# EAGLE design R284A (EAGLE 6.6.0)
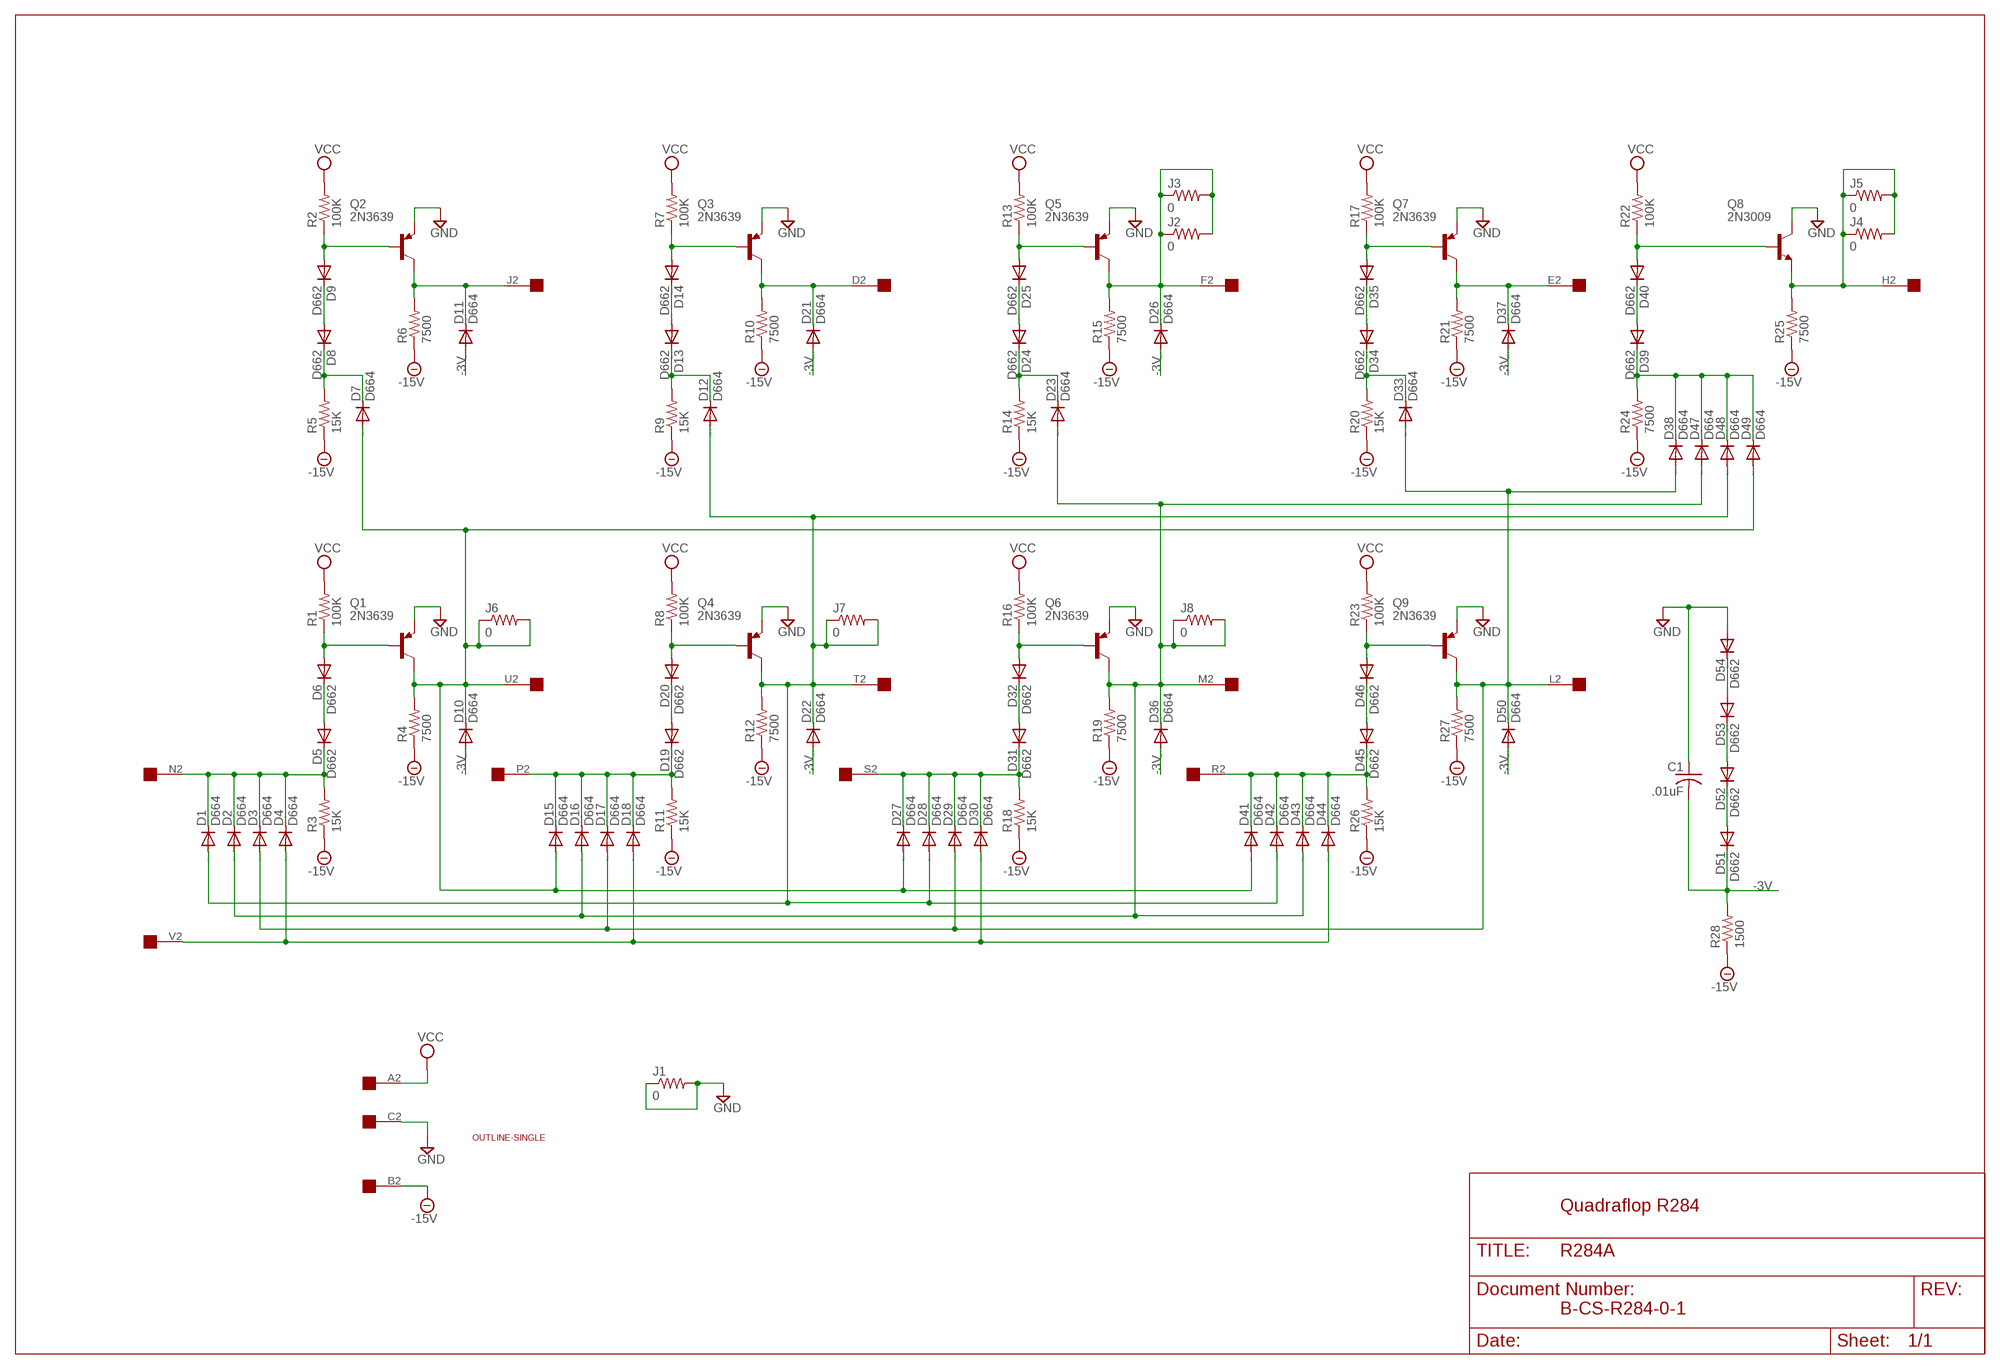
[diagram p0: schematic, sheet 1]

## Parts
C1  .01uF  C-US  [C063-025X075]
D1  D664  DIODE-DO35-10  [DO35-10]
D2  D664  DIODE-DO35-10  [DO35-10]
D3  D664  DIODE-DO35-10  [DO35-10]
D4  D664  DIODE-DO35-10  [DO35-10]
D5  D662  DIODE-DO35-10  [DO35-10]
D6  D662  DIODE-DO35-10  [DO35-10]
D7  D664  DIODE-DO35-10  [DO35-10]
D8  D662  DIODE-DO35-10  [DO35-10]
D9  D662  DIODE-DO35-10  [DO35-10]
D10  D664  DIODE-DO35-10  [DO35-10]
D11  D664  DIODE-DO35-10  [DO35-10]
D12  D664  DIODE-DO35-10  [DO35-10]
D13  D662  DIODE-DO35-10  [DO35-10]
D14  D662  DIODE-DO35-10  [DO35-10]
D15  D664  DIODE-DO35-10  [DO35-10]
D16  D664  DIODE-DO35-10  [DO35-10]
D17  D664  DIODE-DO35-10  [DO35-10]
D18  D664  DIODE-DO35-10  [DO35-10]
D19  D662  DIODE-DO35-10  [DO35-10]
D20  D662  DIODE-DO35-10  [DO35-10]
D21  D664  DIODE-DO35-10  [DO35-10]
D22  D664  DIODE-DO35-10  [DO35-10]
D23  D664  DIODE-DO35-10  [DO35-10]
D24  D662  DIODE-DO35-10  [DO35-10]
D25  D662  DIODE-DO35-10  [DO35-10]
D26  D664  DIODE-DO35-10  [DO35-10]
D27  D664  DIODE-DO35-10  [DO35-10]
D28  D664  DIODE-DO35-10  [DO35-10]
D29  D664  DIODE-DO35-10  [DO35-10]
D30  D664  DIODE-DO35-10  [DO35-10]
D31  D662  DIODE-DO35-10  [DO35-10]
D32  D662  DIODE-DO35-10  [DO35-10]
D33  D664  DIODE-DO35-10  [DO35-10]
D34  D662  DIODE-DO35-10  [DO35-10]
D35  D662  DIODE-DO35-10  [DO35-10]
D36  D664  DIODE-DO35-10  [DO35-10]
D37  D664  DIODE-DO35-10  [DO35-10]
D38  D664  DIODE-DO35-10  [DO35-10]
D39  D662  DIODE-DO35-10  [DO35-10]
D40  D662  DIODE-DO35-10  [DO35-10]
D41  D664  DIODE-DO35-10  [DO35-10]
D42  D664  DIODE-DO35-10  [DO35-10]
D43  D664  DIODE-DO35-10  [DO35-10]
D44  D664  DIODE-DO35-10  [DO35-10]
D45  D662  DIODE-DO35-10  [DO35-10]
D46  D662  DIODE-DO35-10  [DO35-10]
D47  D664  DIODE-DO35-10  [DO35-10]
D48  D664  DIODE-DO35-10  [DO35-10]
D49  D664  DIODE-DO35-10  [DO35-10]
D50  D664  DIODE-DO35-10  [DO35-10]
D51  D662  DIODE-DO35-10  [DO35-10]
D52  D662  DIODE-DO35-10  [DO35-10]
D53  D662  DIODE-DO35-10  [DO35-10]
D54  D662  DIODE-DO35-10  [DO35-10]
J1  0  R-US_0207/10  [0207/10]
J2  0  R-US_0207/10  [0207/10]
J3  0  R-US_0207/10  [0207/10]
J4  0  R-US_0207/10  [0207/10]
J5  0  R-US_0207/10  [0207/10]
J6  0  R-US_0207/10  [0207/10]
J7  0  R-US_0207/10  [0207/10]
J8  0  R-US_0207/10  [0207/10]
Q1  2N3639  -PNP-TO5  [TO5]
Q2  2N3639  -PNP-TO5  [TO5]
Q3  2N3639  -PNP-TO5  [TO5]
Q4  2N3639  -PNP-TO5  [TO5]
Q5  2N3639  -PNP-TO5  [TO5]
Q6  2N3639  -PNP-TO5  [TO5]
Q7  2N3639  -PNP-TO5  [TO5]
Q8  2N3009  -NPN-TO5  [TO5]
Q9  2N3639  -PNP-TO5  [TO5]
R1  100K  R-US_0207/10  [0207/10]
R2  100K  R-US_0207/10  [0207/10]
R3  15K  R-US_0207/10  [0207/10]
R4  7500  R-US_0207/10  [0207/10]
R5  15K  R-US_0207/10  [0207/10]
R6  7500  R-US_0207/10  [0207/10]
R7  100K  R-US_0207/10  [0207/10]
R8  100K  R-US_0207/10  [0207/10]
R9  15K  R-US_0207/10  [0207/10]
R10  7500  R-US_0207/10  [0207/10]
R11  15K  R-US_0207/10  [0207/10]
R12  7500  R-US_0207/10  [0207/10]
R13  100K  R-US_0207/10  [0207/10]
R14  15K  R-US_0207/10  [0207/10]
R15  7500  R-US_0207/10  [0207/10]
R16  100K  R-US_0207/10  [0207/10]
R17  100K  R-US_0207/10  [0207/10]
R18  15K  R-US_0207/10  [0207/10]
R19  7500  R-US_0207/10  [0207/10]
R20  15K  R-US_0207/10  [0207/10]
R21  7500  R-US_0207/10  [0207/10]
R22  100K  R-US_0207/10  [0207/10]
R23  100K  R-US_0207/10  [0207/10]
R24  7500  R-US_0207/10  [0207/10]
R25  7500  R-US_0207/10  [0207/10]
R26  15K  R-US_0207/10  [0207/10]
R27  7500  R-US_0207/10  [0207/10]
R28  1500  R-US_0207/10  [0207/10]
U$1  OUTLINE-SINGLE  [SINGLE]
U$2  EDGE-1  [EDGE-CON1]

## Nets
-3V: C1.2 D10.A D11.A D21.A D22.A D26.A D36.A D37.A D50.A D51.C R28.2
-15V: R3.1 R4.1 R5.1 R6.1 R9.1 R10.1 R11.1 R12.1 R14.1 R15.1 R18.1 R19.1 R20.1 R21.1 R24.1 R25.1 R26.1 R27.1 R28.1 U$2.B2
GND: C1.1 D54.A J1.1 J1.2 Q1.1(E) Q2.1(E) Q3.1(E) Q4.1(E) Q5.1(E) Q6.1(E) Q7.1(E) Q8.3(C) Q9.1(E) U$2.C2
N$1: D9.A Q2.2(B) R2.1
N$2: D11.C Q2.3(C) R6.2 U$2.J2
N$3: D7.C D8.C R5.2
N$4: D8.A D9.C
N$5: D6.A Q1.2(B) R1.1
N$6: D1.C D2.C D3.C D4.C D5.C R3.2 U$2.N2
N$7: D5.A D6.C
N$8: D7.A D10.C D15.A D27.A D41.A D49.A J6.1 J6.2 Q1.3(C) R4.2 U$2.U2
N$9: D1.A D12.A D22.C D28.A D42.A D48.A J7.1 J7.2 Q4.3(C) R12.2 U$2.T2
N$10: D2.A D16.A D23.A D36.C D43.A D47.A J8.1 J8.2 Q6.3(C) R19.2 U$2.M2
N$11: D3.A D17.A D29.A D33.A D38.A D50.C Q9.3(C) R27.2 U$2.L2
N$12: D4.A D18.A D30.A D44.A U$2.V2
N$13: D14.A Q3.2(B) R7.1
N$14: D21.C Q3.3(C) R10.2 U$2.D2
N$15: D12.C D13.C R9.2
N$16: D13.A D14.C
N$17: D20.A Q4.2(B) R8.1
N$18: D15.C D16.C D17.C D18.C D19.C R11.2 U$2.P2
N$19: D19.A D20.C
N$21: D51.A D52.C
N$22: D52.A D53.C
N$23: D53.A D54.C
N$25: D25.A Q5.2(B) R13.1
N$26: D26.C J2.1 J2.2 J3.1 J3.2 Q5.3(C) R15.2 U$2.F2
N$27: D23.C D24.C R14.2
N$28: D24.A D25.C
N$29: D32.A Q6.2(B) R16.1
N$30: D27.C D28.C D29.C D30.C D31.C R18.2 U$2.S2
N$31: D31.A D32.C
N$37: D35.A Q7.2(B) R17.1
N$38: D37.C Q7.3(C) R21.2 U$2.E2
N$39: D33.C D34.C R20.2
N$40: D34.A D35.C
N$41: D46.A Q9.2(B) R23.1
N$42: D41.C D42.C D43.C D44.C D45.C R26.2 U$2.R2
N$43: D45.A D46.C
N$49: D40.A Q8.2(B) R22.1
N$50: J4.1 J4.2 J5.1 J5.2 Q8.1(E) R25.2 U$2.H2
N$51: D38.C D39.C D47.C D48.C D49.C R24.2
N$52: D39.A D40.C
VCC: R1.2 R2.2 R7.2 R8.2 R13.2 R16.2 R17.2 R22.2 R23.2 U$2.A2
Unconnected: U$2.K2

## Notes on the sheet
- Quadraflop R284
- B-CS-R284-0-1

## Library data of the parts
C1 = dec-con:C-US: Capacitors with funky DEC lead spacing.
D1-D54 = diode:DIODE-: DIODE
J1-J8 R1-R28 = rcl:R-US_: RESISTOR, American symbol
Q1-Q7 Q9 = transistor:*-PNP-: PNP Transistror
Q8 = transistor:*-NPN-: NPN Transistror BF959 corrected 2008.03.06
U$1 = dec-con:OUTLINE-*: Board outlines for DEC boards.
U$2 = dec-con:EDGE-1: Single-Sided DEC Edge Connector -- (side 2)

## Board
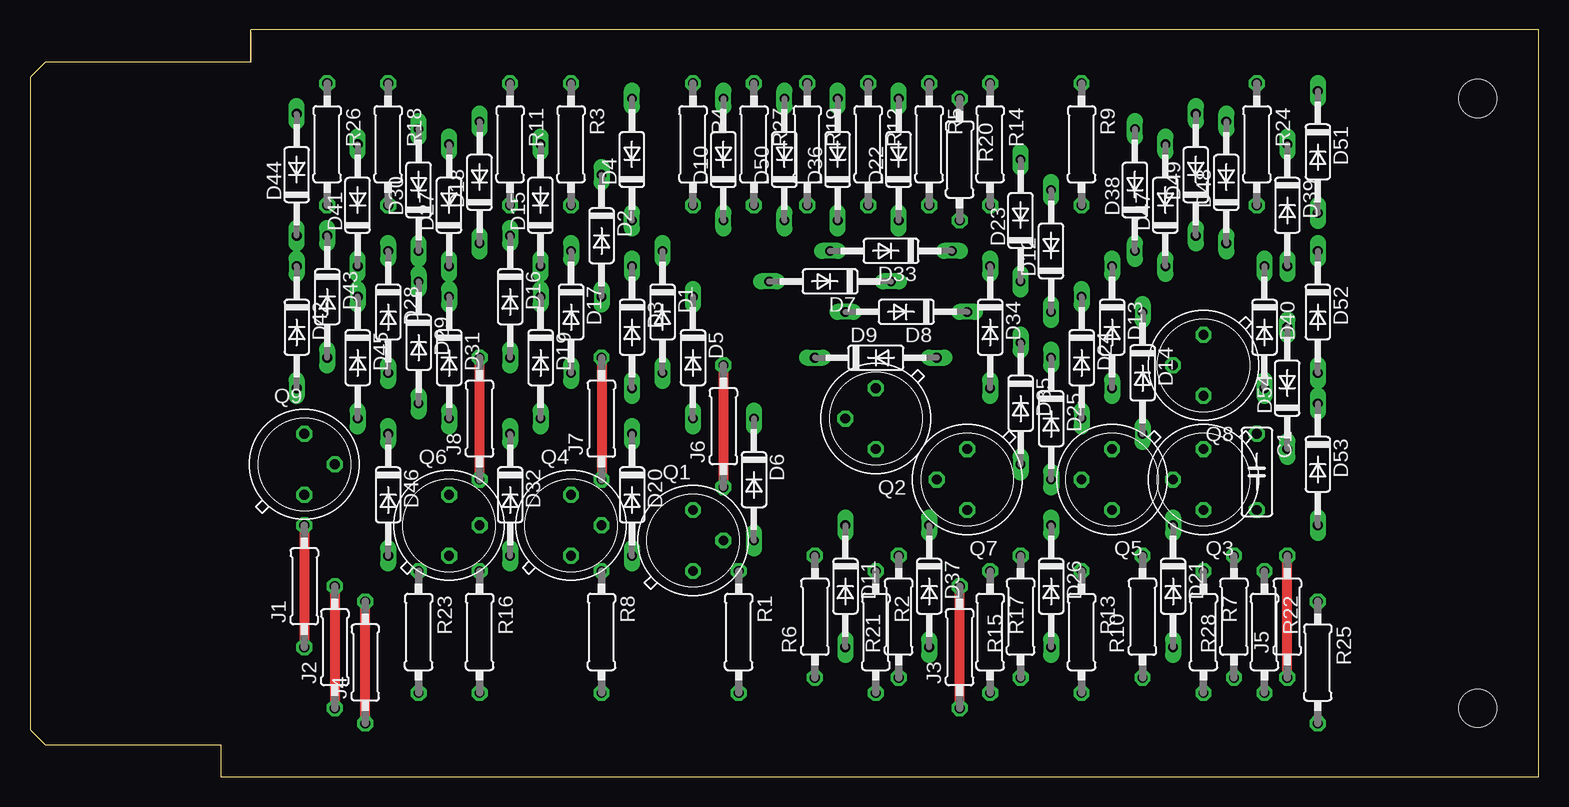
[diagram p1: board, top side]
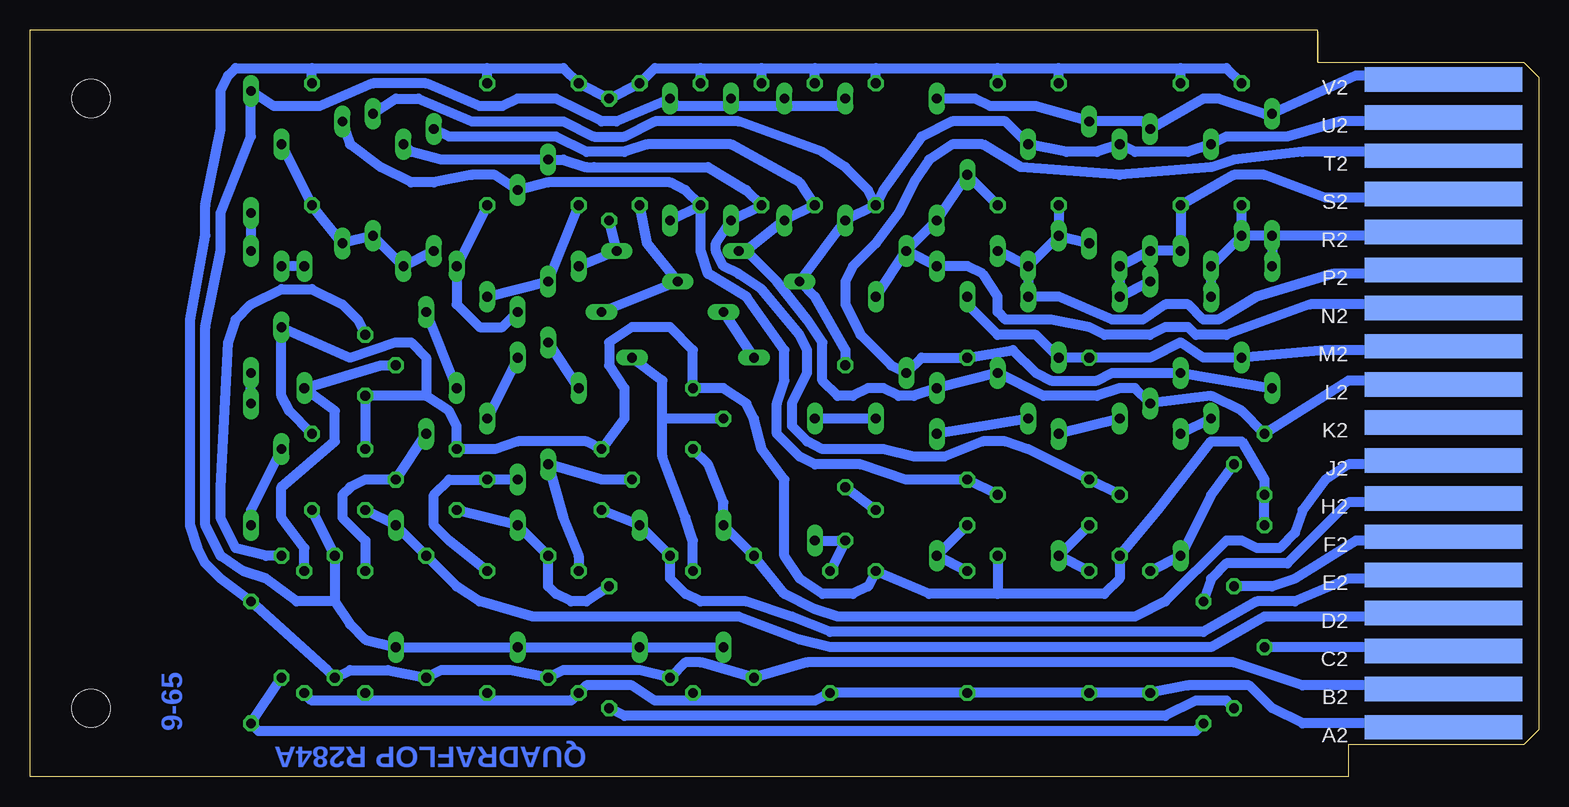
[diagram p2: board, bottom side, seen from below]

Size 125.73 x 62.23 mm. Coordinates in mm from the lower left corner, seen from the top.
Copper layers (1+16): Top 0.035mm / dielectric 1.5mm / Bottom 0.035mm
Design rules "16mils": minimum track width 16mil, minimum drill 32mil, track to track 15mil, track to pad 10mil, pad to pad 10mil, via to via 10mil, smd to smd 10mil, copper to edge 13mil, drill to drill 10mil, minimum pad ring 10mil, minimum via ring 8mil, stop-mask expansion 0mil, vias tented up to drill 0mil, thermal gap 10mil

### Footprints (pad centres in the part's own frame; a part is rotated, then mirrored left to right if it is on the bottom)
C063-025X075 = drill 0.813 octagon: 1 -2.54,0; 2 3.81,0
DO35-10 = drill 0.813 long: A 5.08,0; C -5.08,0
0207/10 = drill 0.813 octagon: 1 -5.08,0; 2 5.08,0
TO5 = drill 0.813 octagon: 1 0,-2.54; 2 2.54,0; 3 0,2.54
SINGLE = hole 3.175: 120.65,56.515; 120.65,5.715
EDGE-CON1 = smd 13.106 x 2.032 bottom: A2 7.938,4.128; B2 7.938,7.303; C2 7.938,10.477; D2 7.938,13.652; E2 7.938,16.828; F2 7.938,20.003; H2 7.938,23.177; J2 7.938,26.352; K2 7.938,29.527; L2 7.938,32.703; M2 7.938,35.877; N2 7.938,39.053; P2 7.938,42.227; R2 7.938,45.403; S2 7.938,48.578; T2 7.938,51.752; U2 7.938,54.928; V2 7.938,58.102

### Placement (x,y rotation side)
C1  102.24,26.04 270 top
D1  52.71,38.73 270 top
D2  47.63,45.09 270 top
D3  50.17,37.47 270 top
D4  50.17,51.44 90 top
D5  55.25,34.92 270 top
D6  60.33,24.77 270 top
D7  66.68,41.27 180 top
D8  73.03,38.73 180 top
D9  70.49,34.92 0 top
D10  57.79,51.44 90 top
D11  67.95,15.88 270 top
D12  85.09,43.81 90 top
D13  90.17,37.47 270 top
D14  92.71,33.66 270 top
D15  42.55,47.62 90 top
D16  40.01,40.01 270 top
D17  45.09,38.73 270 top
D18  37.47,49.53 90 top
D19  42.55,34.92 270 top
D20  50.17,23.5 270 top
D21  95.25,15.88 270 top
D22  72.39,51.44 90 top
D23  82.55,46.35 90 top
D24  87.63,34.92 270 top
D25  85.09,29.84 270 top
D26  85.09,15.88 270 top
D27  34.93,47.62 90 top
D28  29.85,38.73 270 top
D29  32.39,36.2 270 top
D30  32.39,48.9 90 top
D31  34.93,34.92 270 top
D32  40.01,23.5 270 top
D33  71.76,43.81 180 top
D34  80.01,37.47 270 top
D35  82.55,31.11 270 top
D36  67.31,51.44 90 top
D37  74.93,15.88 270 top
D38  92.08,48.9 90 top
D39  104.78,47.62 270 top
D40  102.87,37.47 270 top
D41  27.31,47.62 90 top
D42  22.23,37.47 270 top
D43  24.77,40.01 270 top
D44  22.23,50.16 90 top
D45  27.31,34.92 270 top
D46  29.85,23.5 270 top
D47  94.62,47.62 90 top
D48  99.7,49.53 90 top
D49  97.16,50.16 90 top
D50  62.87,51.44 90 top
D51  107.32,52.07 270 top
D52  107.32,38.73 270 top
D53  107.32,26.04 270 top
D54  104.78,32.38 90 top
J1  22.86,15.88 90 top
J2  25.4,10.79 90 top
J3  77.47,10.79 90 top
J4  27.94,9.53 90 top
J5  104.78,13.34 90 top
J6  57.79,29.21 90 top
J7  47.63,29.84 90 top
J8  37.47,29.84 90 top
Q1  55.25,19.68 0 top
Q2  70.49,29.84 180 top
Q3  97.79,24.77 180 top
Q4  45.09,20.95 0 top
Q5  90.17,24.77 180 top
Q6  34.93,20.95 0 top
Q7  78.11,24.77 180 top
Q8  97.79,34.29 180 top
Q9  22.86,26.04 0 top
R1  59.06,12.06 270 top
R2  70.49,12.06 270 top
R3  45.09,52.7 270 top
R4  55.25,52.7 270 top
R5  74.93,52.7 270 top
R6  65.41,13.34 90 top
R7  97.79,12.06 270 top
R8  47.63,12.06 270 top
R9  87.63,52.7 270 top
R10  92.71,13.34 90 top
R11  40.01,52.7 270 top
R12  69.85,52.7 270 top
R13  87.63,12.06 270 top
R14  80.01,52.7 270 top
R15  82.55,13.34 90 top
R16  37.47,12.06 270 top
R17  80.01,12.06 270 top
R18  29.85,52.7 270 top
R19  64.77,52.7 270 top
R20  77.47,51.44 270 top
R21  72.39,13.34 90 top
R22  102.87,12.06 270 top
R23  32.39,12.06 270 top
R24  102.24,52.7 270 top
R25  107.32,9.53 270 top
R26  24.77,52.7 270 top
R27  60.33,52.7 270 top
R28  100.33,13.34 90 top
U$1  0,0 0 top
U$2  0,0 0 top

### Tracks (layer width: path | path; a pad name or v marks a point on that pad's centre or on a via)
-3V
  Bottom 0.813: C1.2 R28.2 100.33,14.61 | 100.33,14.61 99.06,12.7 97.79,11.43 D21.A D26.A D37.A D11.A | 100.33,14.61 103.51,14.61 106.05,16.51 107.95,17.14 109.86,18.41 111.13,20.95 111.13,37.47 109.86,43.81 109.86,46.99 107.32,53.34 D51.C 105.41,55.88 101.6,55.88 97.16,57.78 92.71,57.78 88.27,55.88 86.36,55.88 85.09,56.52 81.92,56.52 78.11,54.61 76.84,54.61 D22.A 71.76,55.88 67.31,55.88 | D36.A 67.31,55.88 | D10.A 58.42,55.88 62.87,55.88 | 62.87,55.88 67.31,55.88 | D50.A 62.87,55.88
-15V
  Bottom 0.813: U$2.B2 8.89,7.62 19.69,7.62 25.4,9.53 60.96,9.53 R6.1 69.85,9.53 71.12,9.53 R21.1 74.93,8.89 81.28,8.89 R15.1 85.73,8.89 91.44,8.89 R10.1 95.89,8.89 99.06,8.89 R28.1 100.97,8.89 R25.1 109.86,16.51 111.13,17.78 111.76,19.05 112.4,20.95 112.4,38.1 111.13,45.09 111.13,47.62 109.86,53.98 109.86,57.15 109.22,58.42 108.59,59.05 102.24,59.05 | 102.24,59.05 87.63,59.05 | 87.63,59.05 81.28,59.05 R14.1 R20.1 R5.1 73.66,59.05 69.85,59.05 | 69.85,59.05 64.77,59.05 | 64.77,59.05 60.33,59.05 | 60.33,59.05 55.25,59.05 | 55.25,59.05 45.09,59.05 | 45.09,59.05 40.01,59.05 | 40.01,59.05 29.85,59.05 | 29.85,59.05 26.04,59.05 R26.1 | R18.1 29.85,59.05 | R4.1 55.25,59.05 | R27.1 60.33,59.05 | R19.1 64.77,59.05 | R12.1 69.85,59.05 | R3.1 45.09,59.05 | R11.1 40.01,59.05 | R24.1 102.24,59.05 | R9.1 87.63,59.05
GND
  Top 0.813: J1.2 J1.1
  Bottom 0.813: U$2.C2 8.89,10.79 J1.1 | J1.2 Q9.1 22.86,24.77 24.77,27.94 27.31,27.94 31.75,22.23 Q6.1 34.93,16.51 36.2,15.24 45.09,15.24 | Q4.1 45.09,15.24 | 45.09,15.24 50.8,15.24 Q1.1 55.88,15.88 57.15,15.24 59.69,15.24 61.6,16.51 62.87,18.41 62.87,24.77 64.77,27.3 65.41,29.84 66.04,31.11 67.95,32.38 Q2.1 70.49,35.56 72.39,37.47 75.57,37.47 77.47,36.2 77.47,34.29 76.2,32.38 76.2,29.84 Q7.1 79.38,27.94 85.09,27.94 87,27.3 Q5.1 90.17,29.21 90.81,30.48 92.71,31.75 | C1.1 104.14,30.48 104.78,31.75 D54.A 99.06,34.92 95.25,36.2 93.98,36.2 92.71,34.92 92.71,31.75 | 92.71,31.75 Q8.3 Q3.1
N$1
  Bottom 0.813: Q2.2 73.03,29.84 | 73.03,29.84 73.03,33.02 D9.A | R2.1 70.49,19.68 71.12,21.59 73.03,26.67 73.03,29.84
N$2
  Bottom 0.813: U$2.J2 8.26,26.04 15.88,26.04 17.78,24.77 19.69,22.23 20.32,20.32 21.59,19.05 23.5,19.05 24.77,19.68 26.04,19.68 31.12,14.61 33.66,13.34 58.42,13.34 60.33,13.97 62.87,15.24 R6.2 D11.C 67.95,22.86 69.22,26.04 Q2.3
N$3
  Bottom 0.813: D8.C D7.C 74.3,44.45 R5.2
N$4
  Bottom 0.813: D9.C D8.A
N$5
  Bottom 0.813: R1.1 Q1.2 D6.A
N$6
  Bottom 0.813: U$2.N2 8.89,39.37 19.05,39.37 26.04,36.83 28.58,36.83 29.21,37.47 31.12,37.47 32.39,36.83 36.2,36.83 37.47,37.47 40.64,38.1 44.45,38.1 45.09,38.73 45.09,40.01 46.36,41.91 47.63,42.55 D3.C D1.C | R3.2 D2.C D4.C D1.C | D1.C D5.C
N$7
  Bottom 0.813: D5.A D6.C
N$8
  Top 0.813: J6.2 J6.1
  Bottom 0.813: U$2.U2 8.89,54.61 16.51,54.61 20.96,53.34 26.04,53.34 D41.A 29.21,52.07 33.66,52.07 D27.A 36.83,52.07 39.37,52.07 D15.A 44.45,54.61 48.9,54.61 51.44,53.34 54.61,48.9 R4.2 | R4.2 55.88,48.9 57.79,50.8 59.69,52.07 66.68,54.61 73.66,54.61 76.2,53.34 78.74,53.34 81.28,54.61 88.9,54.61 93.35,56.52 95.25,56.52 D49.A | R4.2 D10.C D7.A 60.33,40.01 57.79,35.56 J6.2 | Q1.3 J6.1
N$9
  Top 0.813: J7.2 J7.1
  Bottom 0.813: U$2.T2 8.89,52.07 19.69,52.07 25.4,51.44 27.31,50.8 34.93,50.16 43.18,50.8 46.36,52.7 48.9,52.7 50.8,51.44 52.07,49.53 53.34,46.99 55.25,44.45 57.15,42.55 57.79,41.27 57.79,39.37 56.52,36.83 53.98,34.29 D1.A 51.44,34.92 J7.2 43.82,35.56 41.91,33.66 40.64,33.02 36.83,33.02 35.56,33.66 D28.A D42.A | Q4.3 J7.1 52.71,24.77 56.52,26.04 60.33,26.04 61.6,26.67 63.5,28.57 63.5,31.11 62.87,33.02 62.87,35.56 66.04,40.01 69.22,41.91 69.85,43.81 R12.2 | R12.2 71.12,48.9 72.39,49.53 82.55,49.53 D12.A 87,50.16 88.9,50.16 92.08,49.53 93.98,49.53 96.52,50.8 99.06,52.7 D48.A | D22.C R12.2
N$10
  Top 0.813: J8.1 J8.2
  Bottom 0.813: U$2.M2 8.89,35.56 17.78,35.56 D43.A 27.94,34.92 29.85,36.2 32.39,34.92 J8.2 D16.A 41.91,36.83 45.09,36.83 47.63,39.37 D2.A | Q6.3 J8.1 42.55,27.3 44.45,27.94 46.36,27.94 49.53,26.67 52.07,26.67 54.61,27.3 59.69,27.3 60.96,27.94 62.23,29.21 62.23,31.11 60.96,33.66 60.96,35.56 61.6,36.83 64.77,40.64 66.68,41.91 67.95,42.55 68.58,43.81 68.58,44.45 D36.C R19.2 66.04,48.9 69.22,50.8 78.74,50.8 79.38,50.8 81.28,51.44 D23.A 91.44,51.44 93.98,52.07 D47.A
N$11
  Bottom 0.813: U$2.L2 9.53,33.02 15.88,33.02 Q9.3 24.77,30.48 27.31,31.75 D29.A 33.66,32.38 34.93,32.38 36.83,31.75 41.28,31.75 D17.A D3.A 52.07,31.75 53.34,31.75 54.61,32.38 55.88,32.38 57.15,31.75 58.42,31.75 59.69,33.02 59.69,36.2 60.96,38.1 63.5,41.27 66.04,43.81 | 66.04,43.81 D50.C R27.2 61.6,49.53 67.31,52.7 74.3,52.7 76.2,52.07 79.38,52.07 81.92,53.34 90.81,53.34 D38.A | 66.04,43.81 D33.A
N$12
  Bottom 0.813: U$2.V2 8.89,58.42 15.24,58.42 D44.A 22.86,55.24 26.67,56.52 27.94,56.52 D30.A 33.02,54.61 D18.A 41.91,55.88 45.72,55.88 46.99,56.52 D4.A
N$13
  Bottom 0.813: R7.1 97.79,19.68 99.7,21.59 99.7,23.5 99.06,24.13 97.79,24.77 Q3.2 D14.A
N$14
  Bottom 0.813: U$2.D2 9.53,13.34 22.86,13.34 27.31,10.79 59.06,10.79 61.6,11.43 66.68,13.34 83.82,13.34 88.27,14.61 90.17,15.88 R10.2 D21.C Q3.3
N$15
  Bottom 0.813: R9.2 D13.C 90.17,39.37 88.27,37.47 86.36,37.47 D12.C
N$16
  Bottom 0.813: D13.A D14.C
N$17
  Bottom 0.813: R8.1 D20.A Q4.2
N$18
  Bottom 0.813: U$2.P2 8.89,41.91 17.15,41.91 23.5,40.01 26.67,38.1 27.94,38.1 29.21,39.37 31.12,39.37 33.02,38.1 35.56,38.1 40.01,40.01 D19.C D15.C | R11.2 D16.C | D16.C D18.C | D16.C D15.C | D15.C D17.C
N$19
  Bottom 0.813: D19.A D20.C
N$21
  Bottom 0.813: D51.A D52.C
N$22
  Bottom 0.813: D53.C D52.A
N$23
  Bottom 0.813: D54.C 107.32,22.23 D53.A
N$25
  Bottom 0.813: R13.1 90.81,19.68 92.08,20.95 92.08,23.5 90.81,24.77 Q5.2 D25.A
N$26
  Top 0.813: J2.2 J2.1 | J3.1 J3.2
  Bottom 0.813: U$2.F2 8.89,19.68 15.24,19.68 20.32,16.51 22.23,15.88 J2.2 | J2.1 26.04,6.35 28.58,6.35 31.12,5.08 76.2,5.08 J3.1 | J3.2 79.38,14.61 80.65,14.61 81.92,15.24 82.55,15.88 R15.2 D26.C Q5.3
N$27
  Bottom 0.813: D24.C D23.C R14.2
N$28
  Bottom 0.813: D25.C D24.A
N$29
  Bottom 0.813: R16.1 D32.A Q6.2
N$30
  Bottom 0.813: U$2.S2 9.53,48.26 17.78,48.26 22.86,50.16 25.4,50.16 R18.2 D28.C D30.C D27.C D31.C D29.C
N$31
  Bottom 0.813: D31.A D32.C
N$37
  Bottom 0.813: Q7.2 78.11,24.77 D35.A 81.28,21.59 80.01,18.41 R17.1
N$38
  Bottom 0.813: U$2.E2 8.89,16.51 15.88,16.51 20.32,14.61 23.5,14.61 27.94,12.06 59.06,12.06 62.23,13.34 66.04,14.61 69.85,14.61 71.12,15.24 72.39,16.51 R21.2 D37.C Q7.3
N$39
  Bottom 0.813: D34.C D33.C R20.2
N$40
  Bottom 0.813: D35.C D34.A
N$41
  Bottom 0.813: Q9.2 27.31,23.5 D46.A R23.1
N$42
  Bottom 0.813: U$2.R2 9.53,45.09 D44.C | D44.C D43.C | D43.C D41.C D45.C | D44.C D42.C | D43.C R26.2
N$43
  Bottom 0.813: D45.A D46.C
N$49
  Bottom 0.813: R22.1 102.87,19.05 104.78,21.59 104.78,24.13 100.33,27.94 100.33,30.48 D40.A 96.52,34.29 Q8.2
N$50
  Top 0.813: J4.1 J4.2 | J5.1 J5.2
  Bottom 0.813: U$2.H2 8.89,22.86 15.88,22.86 20.96,17.78 26.04,17.78 27.31,16.51 J4.2 | J4.1 28.58,3.81 106.68,3.81 R25.2 J5.1 | J5.2 106.05,18.41 108.59,19.05 109.86,21.59 109.86,24.13 109.22,36.2 108.59,38.1 107.32,39.37 104.78,40.64 102.24,40.64 99.7,39.37 98.43,38.1 Q8.1
N$51
  Bottom 0.813: D39.C R24.2 D48.C D49.C D47.C D38.C
N$52
  Bottom 0.813: D40.C D39.A
VCC
  Bottom 0.813: U$2.A2 8.26,4.13 8.26,4.45 19.69,4.45 22.23,5.71 24.13,7.62 29.21,7.62 R23.2 R16.2 R8.2 R1.2 60.33,6.35 70.49,6.35 | 70.49,6.35 73.66,6.35 75.57,7.62 79.38,7.62 R17.2 80.65,6.35 87.63,6.35 | 87.63,6.35 97.79,6.35 | 97.79,6.35 102.24,6.35 R22.2 | R13.2 87.63,6.35 | R7.2 97.79,6.35 | R2.2 70.49,6.35

### Text on the board
Bottom: 9-65 | QUADRAFLOP R284A